# Altium project 04_DC_uz_ext_current_sensing_dsub_to_rj45_Rev02.PrjPcb
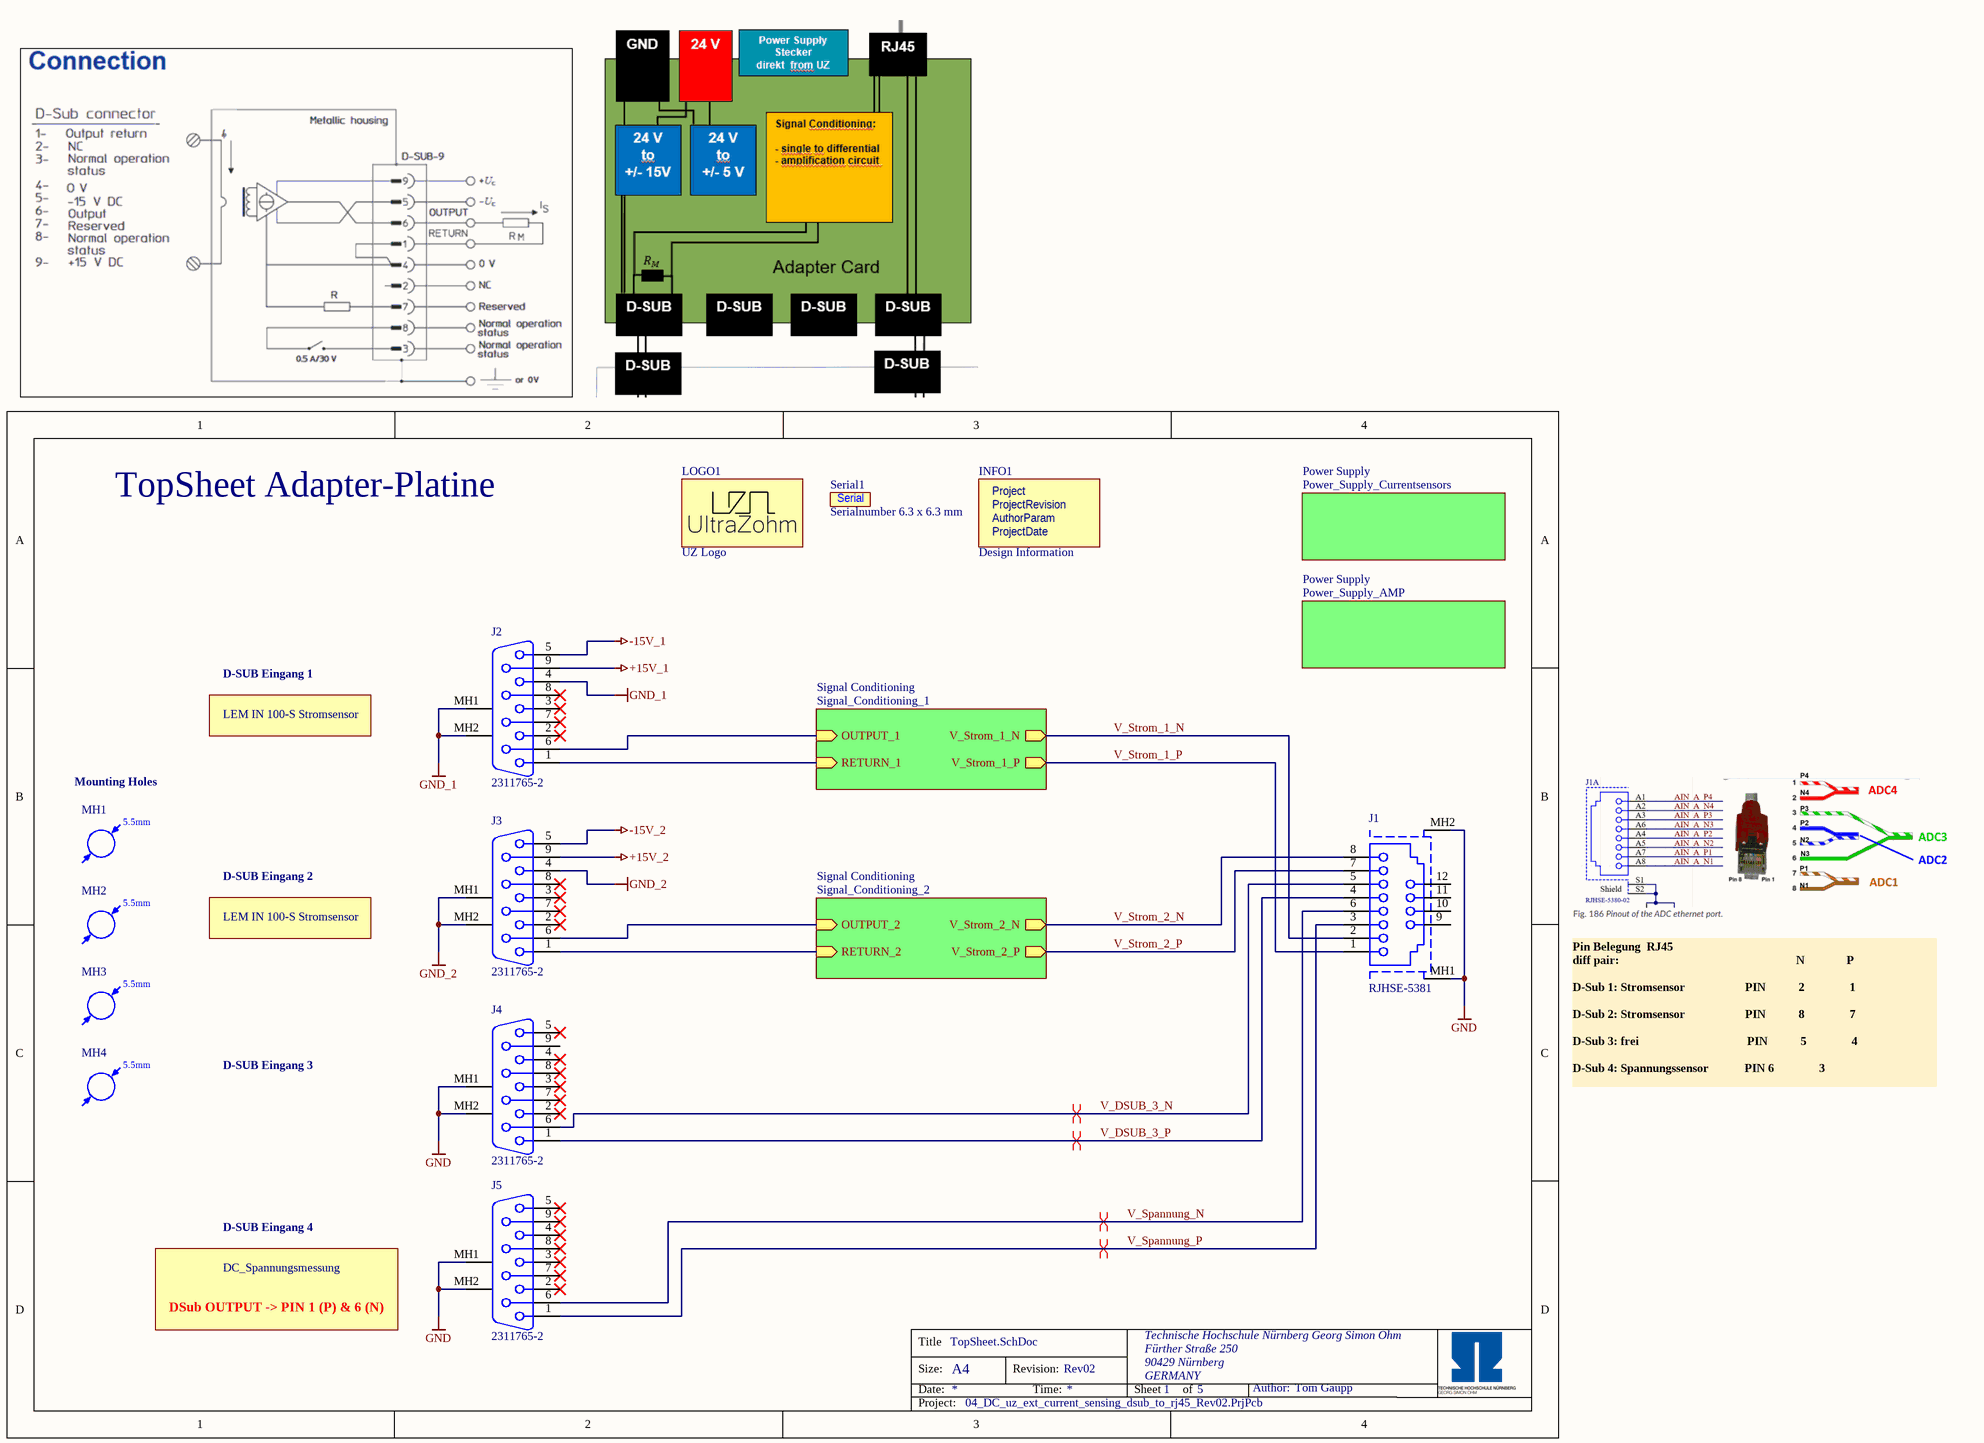
[diagram p0: TopSheet.SchDoc]
Author: Tom Gaupp; AuthorParam: Tom Gaupp; Project: uz_ext_current_sensing_dsub_to_rj45; ProjectDate: 06/24; ProjectRevision: Rev02
5 sheets, 70 parts. Net scope: hierarchical (ports join the sheet entries above them; power ports are global).
Board file: PCB_current_sensing_dsub_to_rj45.PcbDoc
Sheets:
  TopSheet.SchDoc
    Power Supply = Power_Supply_Currentsensors.SchDoc
    Signal Conditioning = Signal_Conditioning_1.SchDoc
    Signal Conditioning = Signal_Conditioning_2.SchDoc
    Power Supply = Power_Supply_AMP.SchDoc

## Sheet TopSheet.SchDoc
size A4; Website: www.ultrazohm.com; Author: Tom Gaupp; CompanyName: Technische Hochschule Nürnberg Georg Simon Ohm; Address1: Fürther Straße 250; Address2: 90429 Nürnberg; Address3: GERMANY; SheetNumber: 1; SheetTotal: 5; CompanyName2: Institut ELSYS

### Parts
INFO1  Design Information  [Design_info]  (no BOM)
J1  RJHSE-5381  [RJHSE-5381]
J2  2311765-2  [23117652]
J3  2311765-2  [23117652]
J4  2311765-2  [23117652]
J5  2311765-2  [23117652]
LOGO1  UZ Logo  [UZ_Logo_small]  (no BOM)
MH1  Mounting_Hole_M5  [Mounting Hole (M5)]  (value not drawn)
MH2  Mounting_Hole_M5  [Mounting Hole (M5)]  (value not drawn)
MH3  Mounting_Hole_M5  [Mounting Hole (M5)]  (value not drawn)
MH4  Mounting_Hole_M5  [Mounting Hole (M5)]  (value not drawn)
Serial1  Serialnumber 6.3 x 6.3 mm  [SERIAL_6.3X6.3MM]  (no BOM)

### Sub-sheets
Power Supply = Power_Supply_Currentsensors: no entries
Power Supply = Power_Supply_AMP: no entries
Signal Conditioning = Signal_Conditioning_1: RETURN_1 (in), OUTPUT_1 (in), V_Strom_1_N (out), V_Strom_1_P (out)
Signal Conditioning = Signal_Conditioning_2: RETURN_2 (in), OUTPUT_2 (in), V_Strom_2_N (out), V_Strom_2_P (out)

### Nets
+15V_1: J2.9
+15V_2: J3.9
-15V_1: J2.5
-15V_2: J3.5
GND: J1.MH1(Shell) J1.MH2(Shell) J4.MH1 J4.MH2 J5.MH1 J5.MH2
GND_1: J2.4 J2.MH1 J2.MH2
GND_2: J3.4 J3.MH1 J3.MH2
V_DSUB_3_N: J1.5 J4.6
V_DSUB_3_P: J1.4 J4.1
V_Spannung_N: J1.6 J5.6
V_Spannung_P: J1.3 J5.1
V_Strom_1_N: J1.2 ; sheet Signal Conditioning/V_Strom_1_N
V_Strom_1_P: J1.1 ; sheet Signal Conditioning/V_Strom_1_P
V_Strom_2_N: J1.8 ; sheet Signal Conditioning/V_Strom_2_N
V_Strom_2_P: J1.7 ; sheet Signal Conditioning/V_Strom_2_P
NetD1_2: J2.6 ; sheet Signal Conditioning/OUTPUT_1
NetD3_2: J2.1 ; sheet Signal Conditioning/RETURN_1
NetD5_2: J3.6 ; sheet Signal Conditioning/OUTPUT_2
NetD7_2: J3.1 ; sheet Signal Conditioning/RETURN_2

Not connected (* = marked no-connect by the designer): J1 9(8) 10(8) 11(8) 12(8); J2 2* 3* 7* 8*; J3 2* 3* 7* 8*; J4 2* 3* 4* 5* 7* 8* 9; J5 2* 3* 4* 5* 7* 8* 9*

### Layout directives
differential pair: V_DSUB_3_N, V_DSUB_3_P, V_Spannung_N, V_Spannung_P

### Notes on the sheet
- TopSheet Adapter-Platine
- D-SUB Eingang 1
- LEM IN 100-S Stromsensor
- Mounting Holes
- D-SUB Eingang 2
- D-SUB Eingang 3
- Pin Belegung  RJ45
  diff pair:                                                           N              P
  D-Sub 1: Stromsensor                    PIN           2               1
  D-Sub 2: Stromsensor                    PIN           8               7
  D-Sub 3: frei                                    PIN           5               4
  D-Sub 4: Spannungssensor            PIN	6               3
- D-SUB Eingang 4
- DSub OUTPUT -> PIN 1 (P) & 6 (N)
- DC_Spannungsmessung
- Title
- Size:
- Date:
- A4
- Revision:
- Time:
- Sheet
- of
- Author:
- Project:
- (in symbol Design Information) Project; ProjectRevision; AuthorParam; ProjectDate
- (in symbol Mounting_Hole_M5) 5.5mm
- (in symbol Serial Number) Serial

### Library data of the parts
INFO1 = Design Information: Design InformationS; Manufacturer: UltraZohm; Created from: MGremer; Manufacturer Part Number: Design Information; PartID: 12; Created On: 03.11.2021 09:04:23; ComponentLink1Description: https://docs.ultrazohm.com/; ComponentLink1URL: homepage; Component Type: Design Information; Last Updated: 03.11.2021 09:28:34; Supplier 1: -; Supplier Part Number 1: -; Type: Design Information; Value: Design Information; Live Cycle Status: 1
J1 = RJHSE-5381: Connector Ethernet R/A RJ45 SHIELDED 8 CONT Y/G LEDS; Supplier 1: Mouser; Supplier Part Number 1: 523-RJHSE-5381
J2-J5 = 2311765-2: Connector D-Sub 9 Pin Female; Manufacturer_Name: TE Connectivity; Datasheet Link: https://www.te.com/commerce/DocumentDelivery/DDEController?Action=showdoc&DocId=Customer+Drawing%7F2311765%7FD%7Fpdf%7FEnglish%7FENG_CD_2311765_D.pdf%7F2311765-2; Height: 12.8mm; Manufacturer_Part_Number: 2311765-2; Mouser Part Number: 571-2311765-2; Mouser Price/Stock: https://www.mouser.co.uk/ProductDetail/TE-Connectivity/2311765-2?qs=rrS6PyfT74frdzrH7SJRfg%3D%3D; Arrow Part Number: 2311765-2; Arrow Price/Stock: https://www.arrow.com/en/products/2311765-2/te-connectivity?region=nac
  J2: Supplier 1: Mouser; Supplier Part Number 1: 571-2311765-2
LOGO1 = Logo small: Manufacturer: UltraZohm; Created from: MGremer; Created: Jan2021_Liegmann; Value: Logo; Manufacturer Part Number: Logo small; PartID: 10; Created On: 03.11.2021 09:04:23; ComponentLink1Description: https://docs.ultrazohm.com/; ComponentLink1URL: homepage; Component Type: Logo; Last Updated: 03.11.2021 09:05:50; Supplier 1: -; Supplier Part Number 1: -; Type: Logo; Live Cycle Status: 1
MH1-MH4 = Mounting_Hole_M5: Mounting Hole
Serial1 = Serial Number: Manufacturer: UltraZohm; Value: REV; Created from: MGremer; Created: 2018_09_18_AGeiger; Manufacturer Part Number: Serial Number; PartID: 11; Created On: 03.11.2021 09:04:23; ComponentLink1Description: https://docs.ultrazohm.com/; ComponentLink1URL: homepage; Component Type: Serial Number; Last Updated: 03.11.2021 09:28:34; Supplier 1: -; Supplier Part Number 1: -; Type: Serial Number; Live Cycle Status: 1

## Sheet Power_Supply_Currentsensors.SchDoc
size A4; Author: Tom Gaupp; CompanyName: Technische Hochschule Nürnberg Georg Simon Ohm; Address1: Fürther Straße 250; Address2: 90429 Nürnberg; Address3: GERMANY; SheetNumber: 2; SheetTotal: 5; CompanyName2: Institut ELSYS
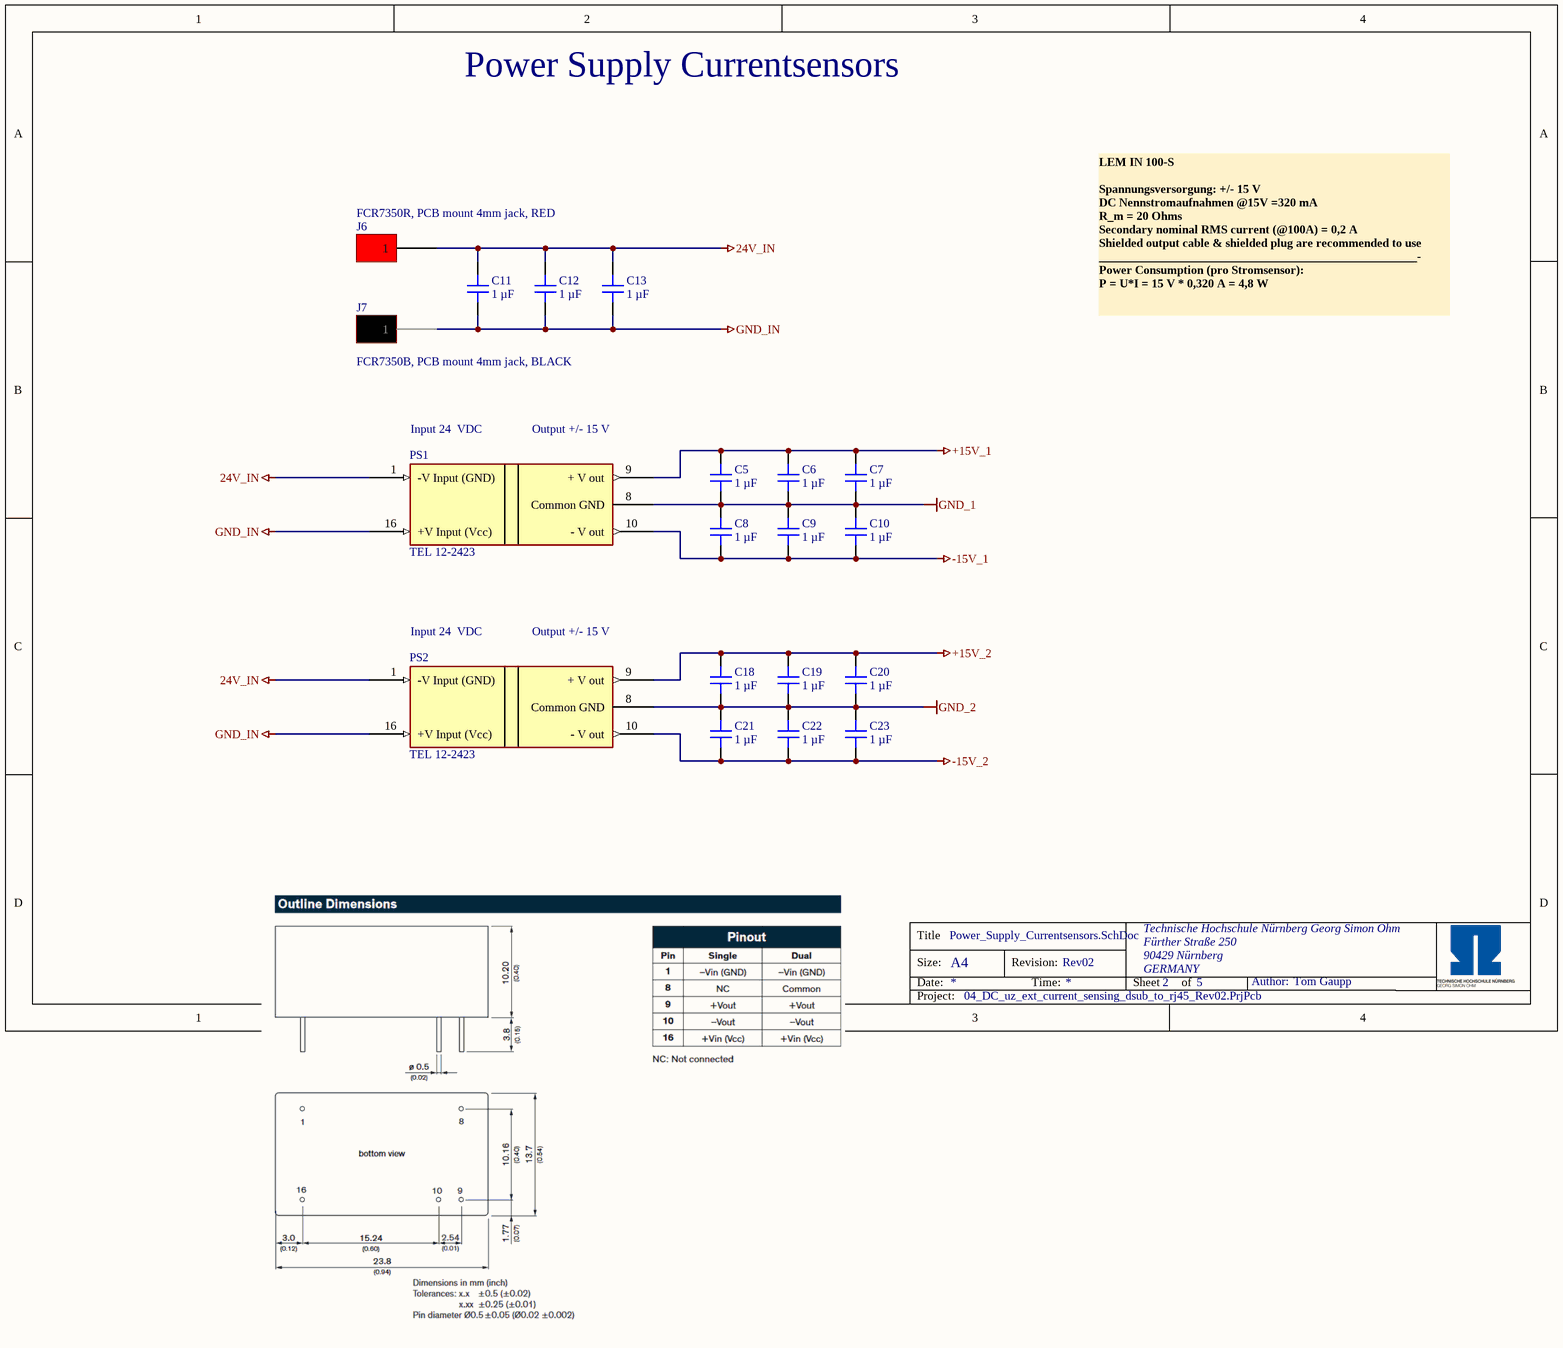
[diagram p1: Power_Supply_Currentsensors.SchDoc]

### Parts
C5  1 µF  [C_0603]
C6  1 µF  [C_0603]
C7  1 µF  [C_0603]
C8  1 µF  [C_0603]
C9  1 µF  [C_0603]
C10  1 µF  [C_0603]
C11  1 µF  [C_0603]
C12  1 µF  [C_0603]
C13  1 µF  [C_0603]
C18  1 µF  [C_0603]
C19  1 µF  [C_0603]
C20  1 µF  [C_0603]
C21  1 µF  [C_0603]
C22  1 µF  [C_0603]
C23  1 µF  [C_0603]
J6  FCR7350R, PCB mount 4mm jack, RED  [FCR7350]
J7  FCR7350B, PCB mount 4mm jack, BLACK  [FCR7350]
PS1  TEL 12-2423  [TEL 12-2423]
PS2  TEL 12-2423  [TEL 12-2423]

### Nets
24V_IN: C11.1 C12.1 C13.1 J6.1 PS1.1(-V_Input_(GND)) PS2.1(-V_Input_(GND))
+15V_1: C5.2 C6.2 C7.2 PS1.9(+_V_out)
+15V_2: C18.2 C19.2 C20.2 PS2.9(+_V_out)
-15V_1: C8.1 C9.1 C10.1 PS1.10(-_V_out)
-15V_2: C21.1 C22.1 C23.1 PS2.10(-_V_out)
GND_1: C5.1 C6.1 C7.1 C8.2 C9.2 C10.2 PS1.8(Common_GND)
GND_2: C18.1 C19.1 C20.1 C21.2 C22.2 C23.2 PS2.8(Common_GND)
GND_IN: C11.2 C12.2 C13.2 J7.1 PS1.16(+V_Input_(Vcc)) PS2.16(+V_Input_(Vcc))

### Notes on the sheet
- Power Supply Currentsensors
- LEM IN 100-S
  Spannungsversorgung: +/- 15 V
  DC Nennstromaufnahmen @15V =320 mA
  R_m = 20 Ohms
  Secondary nominal RMS current (@100A) = 0,2 A
  Shielded output cable & shielded plug are recommended to use
  _____________________________________________________-
  Power Consumption (pro Stromsensor):
  P = U*I = 15 V * 0,320 A = 4,8 W
- (near PS1) Input 24  VDC
- (near PS1) Output +/- 15 V
- (near PS2) Input 24  VDC
- (near PS2) Output +/- 15 V
- Title
- Size:
- Date:
- A4
- Revision:
- Time:
- Sheet
- of
- Author:
- Project:

### Library data of the parts
C5-C13 C18-C23 = CL10A105KB8NNNC: 50V 1uF X5R ±10% 0603  Multilayer Ceramic Capacitors MLCC - SMD/SMT ROHS; Manufacturer: Samsung Electro-Mechanics; Voltage Rating: 50 VDC; Created from: MGremer; Supplier 1: LCSC; Supplier Part Number 1: C15849; Manufacturer Part Number: CL10A105KB8NNNC; Value: 1 µF; PartID: 5; Created On: 20.12.2020 13:54:13; ComponentLink1Description: Datasheet; ComponentLink1URL: https://datasheet.lcsc.com/lcsc/1810261812_Samsung-Electro-Mechanics-CL10A105KB8NNNC_C15849.pdf; Component Type: Capacitor 0603; Device Package: 0603; Last Updated: 28.11.2022 17:23:01; Mounting Type: SMD; Operating Temperature: -55 - 85°C; Series: M; Type: Capacitor; Tolerance: 10 %; Live Cycle Status: 1; LCSC Part Number: C15849; Stock number: Labor SMD Container
J6 = FCR7350R: FCR7350B, 1000V, 24A, RED; Manufacturer: Cliff; Value: PCB mount 4mm jack, Red FCR7350R, 1000V, 24A; Created from: DHufnagel; Manufacturer Part Number: FCR7350R; PartID: 7; Created On: 13.06.2022 10:18:11; ComponentLink1Description: datasheet; ComponentLink1URL: https://www.cliffuk.co.uk/products/testleads/sockets/S16NPC.pdf; ComponentLink2Description: drawing; ComponentLink2URL: https://media.digikey.com/pdf/Data%20Sheets/Cliff%20Electronic%20LTD%20PDF's/FCR7350_Drawing.pdf; Component Type: PCB mount 4mm jack, Red; Device Package: THT; Last Updated: 28.06.2022 13:58:37; Minimum Order: 1; Mounting Type: THT; Operating Temperature: -40°C - 80°C; Series: S16N-PC; Supplier 1: Digi-Key; Supplier Part Number 1: 3185-FCR7350R-ND; Supplier 2: farnell; Supplier Part Number 2: 1854508; Type: PCB mount 4mm jack, Red FCR7350R, 1000V, 24A; Live Cycle Status: 1; Stock number: not stored
J7 = FCR7350B: FCR7350B, 1000V, 24A, BLACK; Manufacturer: Cliff; Value: PCB mount 4mm jack, Black	FCR7350B, 1000V, 24A; Created from: DHufnagel; Manufacturer Part Number: FCR7350B; PartID: 6; Created On: 13.06.2022 10:18:11; ComponentLink1Description: datasheet; ComponentLink1URL: https://www.cliffuk.co.uk/products/testleads/sockets/S16NPC.pdf; ComponentLink2Description: drawing; ComponentLink2URL: https://media.digikey.com/pdf/Data%20Sheets/Cliff%20Electronic%20LTD%20PDF's/FCR7350_Drawing.pdf; Component Type: PCB mount 4mm jack, Black; Device Package: THT; Last Updated: 28.06.2022 13:58:37; Minimum Order: 1; Mounting Type: THT; Operating Temperature: -40°C - 80°C; Series: S16N-PC; Supplier 1: Digi-Key; Supplier Part Number 1: 3185-FCR7350B-ND; Supplier 2: farnell; Supplier Part Number 2: 1854507; Type: PCB mount 4mm jack, Black	FCR7350B, 1000V, 24A; Live Cycle Status: 1; Stock number: not stored
PS1 PS2 = TEL 12-2423: Isolierte DC/DC-Wandler – Durchsteckmontage 18-36Vin+/-15V 400mA 12W DIP Iso; Parameter 1: *; Supplier 1: Mouser; Supplier Part Number 1: 490-PGNM1-S24-S5-S

## Sheet Signal_Conditioning_1.SchDoc
size A4; Author: Tom Gaupp; CompanyName: Technische Hochschule Nürnberg Georg Simon Ohm; Address1: Fürther Straße 250; Address2: 90429 Nürnberg; Address3: GERMANY; SheetNumber: 4; SheetTotal: 5; CompanyName2: Institut ELSYS
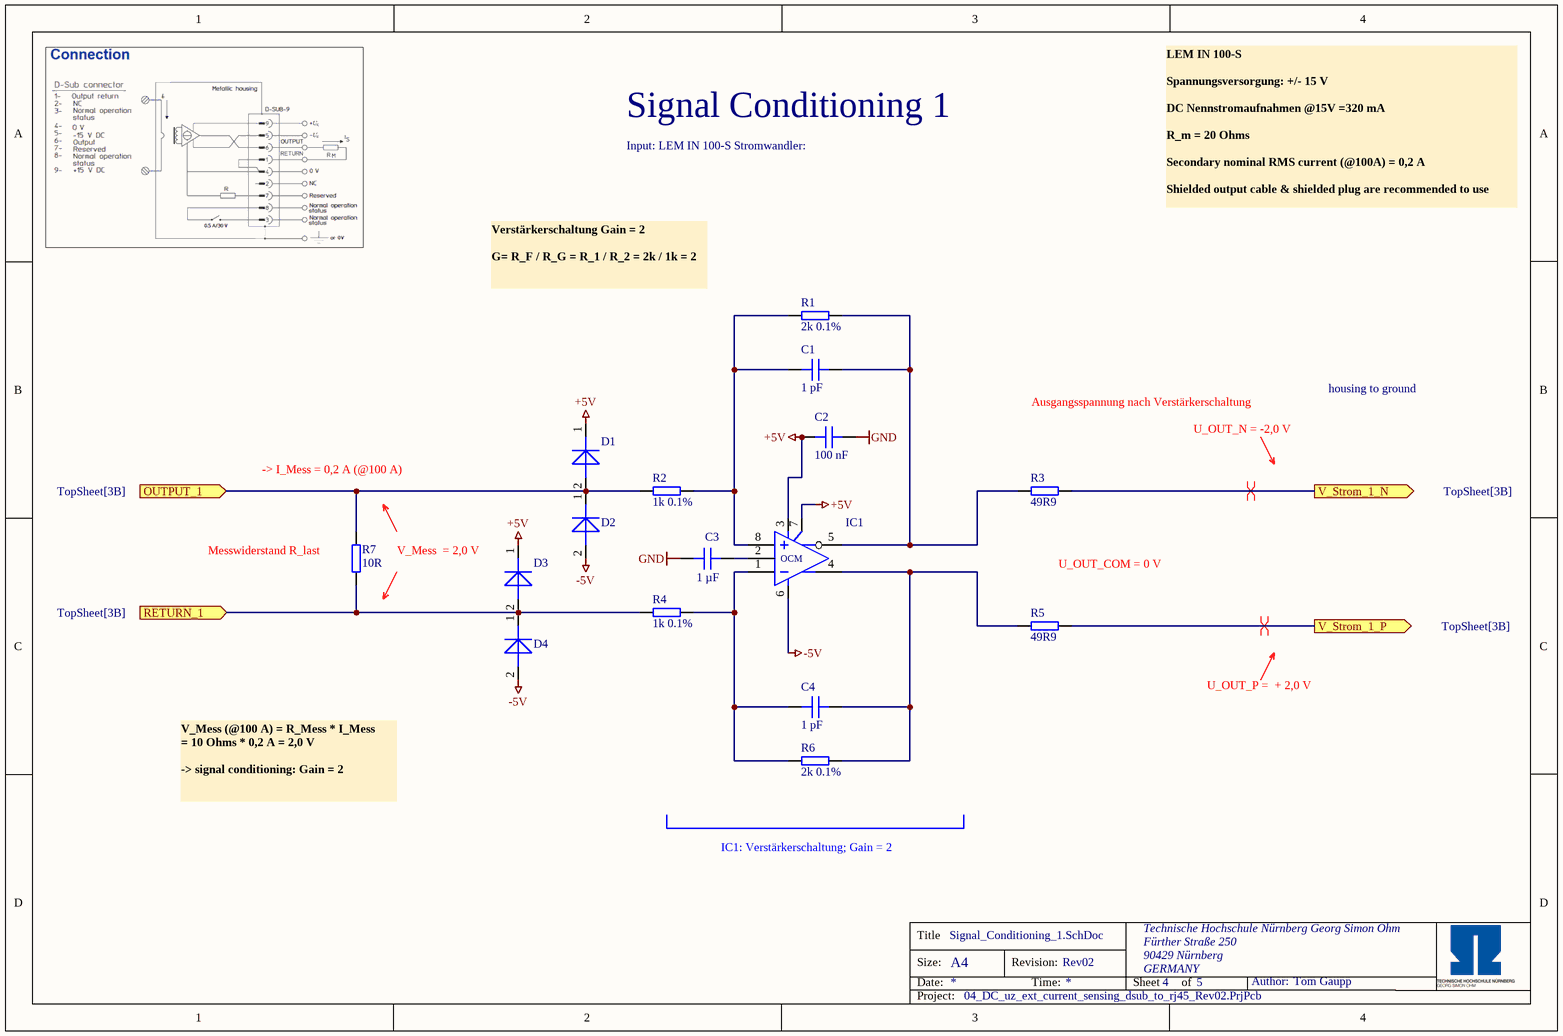
[diagram p2: Signal_Conditioning_1.SchDoc]

### Parts
C1  1 pF  [C_0603]
C2  100 nF  [C_0603]
C3  1 µF  [C_0603]
C4  1 pF  [C_0603]
D1  1SS356VMFHTE-17  [1SS356VMFHTE17]  (value not drawn)
D2  1SS356VMFHTE-17  [1SS356VMFHTE17]  (value not drawn)
D3  1SS356VMFHTE-17  [1SS356VMFHTE17]  (value not drawn)
D4  1SS356VMFHTE-17  [1SS356VMFHTE17]  (value not drawn)
IC1  ADA4940-1ARZ-R7  [SOIC-8-N]  (value not drawn)
R1  2k 0.1%  [RES 1206_3216]
R2  1k 0.1%  [RES 1206_3216]
R3  49R9  [RES 0603_1608]
R4  1k 0.1%  [RES 1206_3216]
R5  49R9  [RES 0603_1608]
R6  2k 0.1%  [RES 1206_3216]
R7  10R  [RES 1206_3216]

### Ports
OUTPUT_1 (in, see TopSheet[3B]), RETURN_1 (in, see TopSheet[3B]), V_Strom_1_N (out, see TopSheet[3B]), V_Strom_1_P (out, see TopSheet[3B])

### Nets
+5V: C2.1 D1.1(K) D3.1(K) IC1.3(V+) IC1.7(EN)
-5V: D2.2(A) D4.2(A) IC1.6(V-)
GND: C2.2 C3.1
V_Strom_1_N: R3.2 ; port V_Strom_1_N
V_Strom_1_P: R5.2 ; port V_Strom_1_P
NetC1_1: C1.1 IC1.8(+) R1.1 R2.2
NetC1_2: C1.2 IC1.5(Out) R1.2 R3.1
NetC3_2: C3.2 IC1.2(OCM)
NetC4_1: C4.1 IC1.1(-) R4.2 R6.1
NetC4_2: C4.2 IC1.4(Out) R5.1 R6.2
NetD1_2: D1.2(A) D2.1(K) R2.1 R7.2 ; port OUTPUT_1
NetD3_2: D3.2(A) D4.1(K) R4.1 R7.1 ; port RETURN_1

### Layout directives
differential pair: V_Strom_1_N, V_Strom_1_P

### Notes on the sheet
- Signal Conditioning 1
- Input: LEM IN 100-S Stromwandler:
- LEM IN 100-S
  Spannungsversorgung: +/- 15 V
  DC Nennstromaufnahmen @15V =320 mA
  R_m = 20 Ohms
  Secondary nominal RMS current (@100A) = 0,2 A
  Shielded output cable & shielded plug are recommended to use
- Verstärkerschaltung Gain = 2
  G= R_F / R_G = R_1 / R_2 = 2k / 1k = 2
- Ausgangsspannung nach Verstärkerschaltung
- U_OUT_N = -2,0 V
- housing to ground
- -> I_Mess = 0,2 A (@100 A)
- (near R7) Messwiderstand R_last
- V_Mess  = 2,0 V
- U_OUT_COM = 0 V
- U_OUT_P =  + 2,0 V
- V_Mess (@100 A) = R_Mess * I_Mess
  = 10 Ohms * 0,2 A = 2,0 V
  -> signal conditioning: Gain = 2
- IC1: Verstärkerschaltung; Gain = 2
- Title
- Size:
- Date:
- A4
- Revision:
- Time:
- Sheet
- of
- Author:
- Project:

### Library data of the parts
C1 C4 = KGM15ACG1H1R0BT: Multilayer Ceramic Capacitors MLCC - SMD/SMT 50V 1pF C0G 0603 +/-.1pF; Manufacturer: KYOCERA AVX; Tolerance: 10%; Voltage Rating: 50 VDC; Created from: TGaupp; Manufacturer Part Number: KGM15ACG1H1R0BT; PartID: 147; Created On: 13.02.2024 08:51:22; ComponentLink1Description: Datasheet; ComponentLink1URL: https://www.mouser.de/datasheet/2/40/C0GNP0_KGM-3216332.pdf; Component Type: Capacitor 0603; Device Package: 0603; Last Updated: 13.02.2024 08:51:22; Mounting Type: SMD; Operating Temperature: -55 to +125°C; Series: C0G; Supplier 1: Mouser; Supplier Part Number 1: 581-KGM15ACG1H1R0BT; Type: Capacitor; Value: 1 pF; Live Cycle Status: 1
C2 = C0603C104K9PACTU: Capacitor 0603, 6.3 VDC, 100 nF, X5R; Manufacturer: KEMET; Tolerance: 10 %; Voltage Rating: 6.3 VDC; Created from: MGremer; Manufacturer Part Number: C0603C104K9PACTU; PartID: 70; Created On: 20.12.2020 13:54:13; ComponentLink1Description: Datasheet; ComponentLink1URL: https://www.mouser.de/datasheet/2/212/KEM_C1006_X5R_SMD-1103249.pdf; Component Type: Capacitor 0603; Device Package: 0603; Last Updated: 20.01.2021 13:57:36; Mounting Type: SMD; Operating Temperature: -55 - 85°C; Series: SMD Comm X5R; Supplier 1: Mouser; Supplier Part Number 1: 80-C0603C104K9P; Type: Capacitor; Value: 100 nF; Live Cycle Status: 1; Stock number: not stored
C3 = CL10A105KB8NNNC: as C5 on sheet Power_Supply_Currentsensors; Supplier 1: LCSC; Supplier Part Number 1: C15849; Manufacturer Part Number: CL10A105KB8NNNC; Value: 1 µF; PartID: 5; Created On: 20.12.2020 13:54:13; ComponentLink1Description: Datasheet; ComponentLink1URL: https://datasheet.lcsc.com/lcsc/1810261812_Samsung-Electro-Mechanics-CL10A105KB8NNNC_C15849.pdf; Component Type: Capacitor 0603; Device Package: 0603; Last Updated: 28.11.2022 17:23:01; Mounting Type: SMD; Operating Temperature: -55 - 85°C; Series: M; Type: Capacitor; Tolerance: 10 %; Live Cycle Status: 1; LCSC Part Number: C15849; Stock number: Labor SMD Container
D1-D4 = 1SS356VMFHTE-17: Diode; Manufacturer_Name: ROHM Semiconductor; Datasheet Link: https://fscdn.rohm.com/en/products/databook/datasheet/discrete/diode/switching/1ss355vmfhte-17-e.pdf; Height: 0.9mm; Manufacturer_Part_Number: 1SS356VMFHTE-17; Mouser Part Number: 755-1SS356VMFHTE-17; Mouser Price/Stock: https://www.mouser.co.uk/ProductDetail/ROHM-Semiconductor/1SS356VMFHTE-17?qs=doiCPypUmgG12xHjyvfQdg%3D%3D; Supplier 1: Mouser; Supplier Part Number 1: 755-1SS356VMFHTE-17
IC1 = ADA4940-1ARZ-R7: Differential ADC Driver; Manufacturer: Analog Devices; Class I: Analog; Class II: Fully Differential ADC Drivers (-40-125°C); Best.-Nr.: Farnell 209-6178; Channels: 1; Created from: MGremer; Datasheet: DSO11449, Ver. Aug 2000; Last edited: 04.01.2007 10:14; Package Reference: SOIC-N-8; Manufacturer Part Number: ADA4940-1ARZ-R7; PartID: 3; Created On: 15.01.2021 12:16:53; ComponentLink1Description: Datasheet; ComponentLink1URL: https://www.mouser.de/datasheet/2/609/ADA4940-1_4940-2-878284.pdf; Component Type: ADC; Device Package: SOIC-8; Last Updated: 22.11.2021 15:19:18; Mounting Type: SMD; Operating Temperature: -40 - 105 °C; Supplier 1: Mouser; Supplier Part Number 1: 584-ADA4940-1ARZ-R7; Type: ADC; Resolution: -; Value: differential ADC driver; Live Cycle Status: 1; Stock number: not stored
R1 R6 = TNPW12062K00BEEA: SMD resistor 2Kohms .1% 400mW 25ppm; Manufacturer: Vishay; Created from: TGaupp; Manufacturer Part Number: TNPW12062K00BEEA; PartID: 323; Created On: 12.02.2024 09:48:36; ComponentLink1Description: Datasheet; ComponentLink1URL: https://www.vishay.com/docs/28758/tnpw_e3.pdf; Component Type: SMD resistor; Device Package: 1206; Last Updated: 12.02.2024 09:48:36; Mounting Type: SMD; Supplier 1: Mouser; Supplier Part Number 1: 71-TNPW12062K00BEEA; Type: Resistor; Tolerance: 0.1%; Value: 2k; Live Cycle Status: 1; Stock number: not stored
R2 R4 = ERA-8AEB102V: SMD resistor 1/4W 1.0Kohm 0.1% 25ppm; Manufacturer: Panasonic; Created from: TGaupp; Manufacturer Part Number: ERA-8AEB102V; PartID: 292; Created On: 08.08.2023 13:03:51; ComponentLink1Description: Datasheet; ComponentLink1URL: https://www.mouser.de/datasheet/2/315/AOA0000C307-1149632.pdf; Component Type: SMD resistor; Device Package: 1206; Last Updated: 08.08.2023 13:03:51; Mounting Type: SMD; Supplier 1: Mouser; Supplier Part Number 1: 667-ERA-8AEB102V; Type: Resistor; Tolerance: 0.1%; Value: 1k; Live Cycle Status: 1; Stock number: not stored; LCSC Part Number: C2079586
R3 R5 = RC0603FR-0749R9L: 100mW Thick Film Resistors ±100ppm/℃ ±1% 49.9Ω 0603 Chip Resistor - Surface Mount ROHS; Manufacturer: YAGEO; Created from: AGeiger; Manufacturer Part Number: RC0603FR-0749R9L; PartID: 277; Created On: 14.06.2023 17:42:26; ComponentLink1Description: Datasheet; ComponentLink1URL: https://datasheet.lcsc.com/lcsc/2304140030_YAGEO-RC0603FR-0749R9L_C114625.pdf; Component Type: SMD resistor; Device Package: 0603; Last Updated: 14.06.2023 17:42:26; Mounting Type: SMD; Type: Resistor; Tolerance: 1%; Value: 49R9; Live Cycle Status: 1; LCSC Part Number: C114625; Supplier 1: Mouser; Supplier Part Number 1: 603-RC0402FR-0749R9L
R7 = SG73G2BTTD10R0D: SMD 10 ohm 0.5% 0.5W; Manufacturer: KOA Speer; Created from: TGaupp; Manufacturer Part Number: SG73G2BTTD10R0D; PartID: 329; Created On: 13.03.2024 10:06:45; ComponentLink1Description: Datasheet; ComponentLink1URL: https://www.koaspeer.com/pdfs/SG73G.pdf; Component Type: SMD resistor; Device Package: 1206; Last Updated: 13.03.2024 10:06:45; Mounting Type: SMD; Supplier 1: Mouser; Supplier Part Number 1: 660-SG73G2BTTD10R0D; Type: Resistor; Tolerance: 0.5%; Value: 10R; Live Cycle Status: 1; Stock number: not stored

## Sheet Signal_Conditioning_2.SchDoc
size A4; Author: Tom Gaupp; CompanyName: Technische Hochschule Nürnberg Georg Simon Ohm; Address1: Fürther Straße 250; Address2: 90429 Nürnberg; Address3: GERMANY; SheetNumber: 5; SheetTotal: 5; CompanyName2: Institut ELSYS
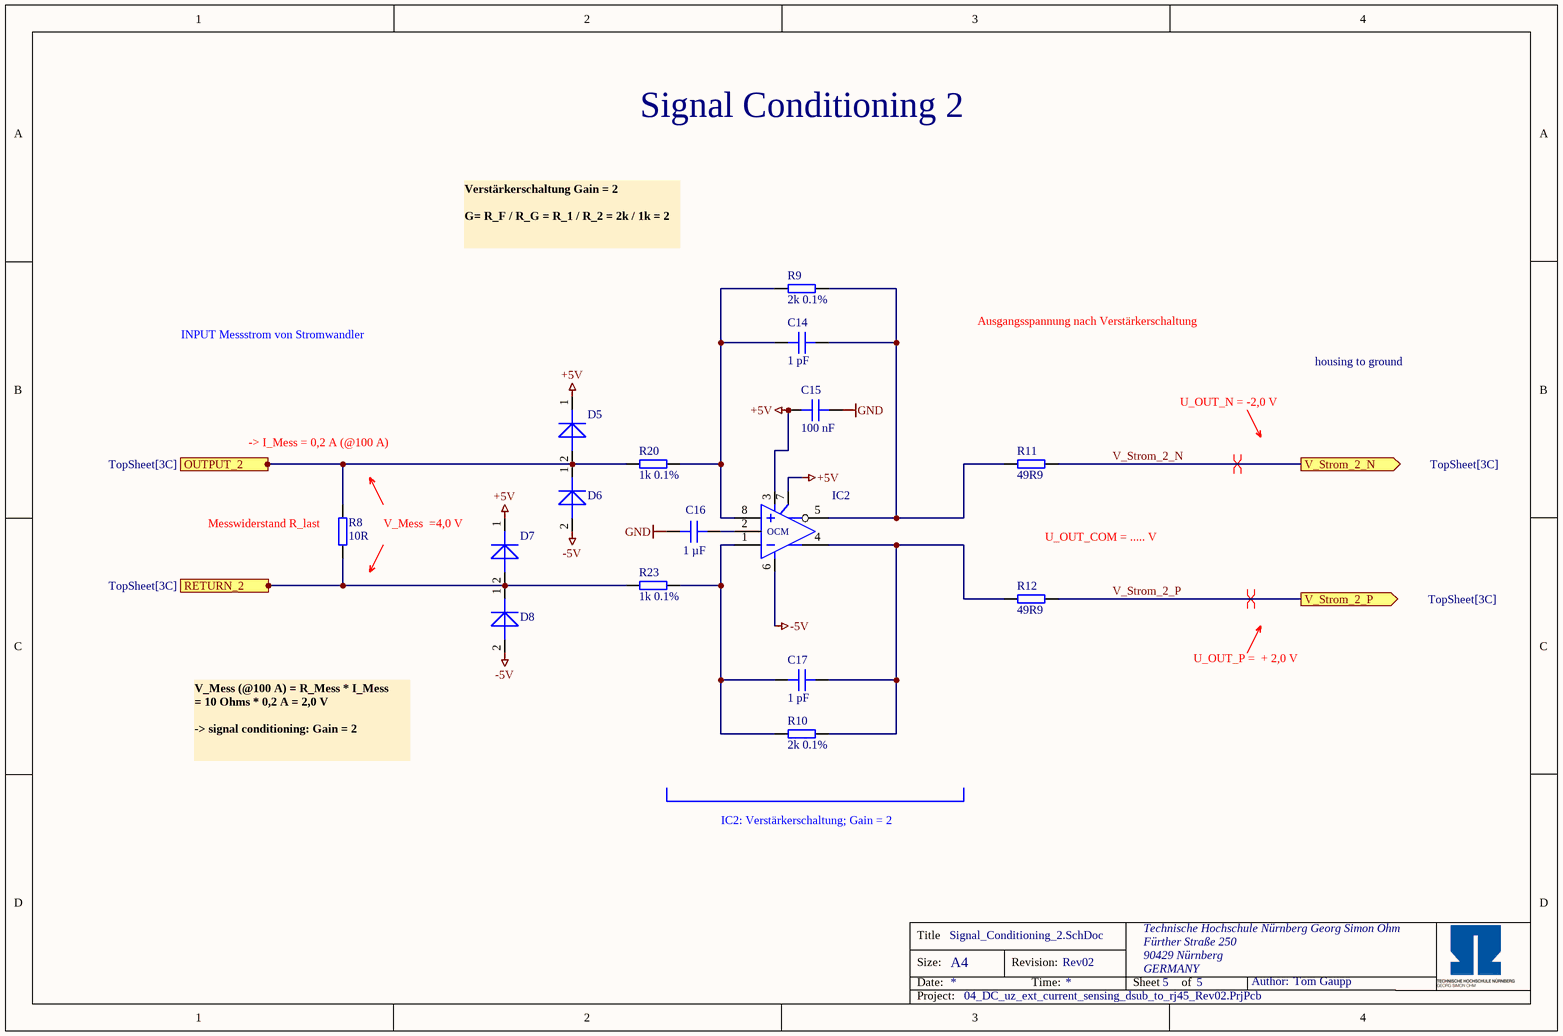
[diagram p3: Signal_Conditioning_2.SchDoc]

### Parts
C14  1 pF  [C_0603]
C15  100 nF  [C_0603]
C16  1 µF  [C_0603]
C17  1 pF  [C_0603]
D5  1SS356VMFHTE-17  [1SS356VMFHTE17]  (value not drawn)
D6  1SS356VMFHTE-17  [1SS356VMFHTE17]  (value not drawn)
D7  1SS356VMFHTE-17  [1SS356VMFHTE17]  (value not drawn)
D8  1SS356VMFHTE-17  [1SS356VMFHTE17]  (value not drawn)
IC2  ADA4940-1ARZ-R7  [SOIC-8-N]  (value not drawn)
R8  10R  [RES 1206_3216]
R9  2k 0.1%  [RES 1206_3216]
R10  2k 0.1%  [RES 1206_3216]
R11  49R9  [RES 0603_1608]
R12  49R9  [RES 0603_1608]
R20  1k 0.1%  [RES 1206_3216]
R23  1k 0.1%  [RES 1206_3216]

### Ports
OUTPUT_2 (in, see TopSheet[3C]), RETURN_2 (in, see TopSheet[3C]), V_Strom_2_N (out, see TopSheet[3C]), V_Strom_2_P (out, see TopSheet[3C])

### Nets
+5V: C15.1 D5.1(K) D7.1(K) IC2.3(V+) IC2.7(EN)
-5V: D6.2(A) D8.2(A) IC2.6(V-)
GND: C15.2 C16.1
V_Strom_2_N: R11.2 ; port V_Strom_2_N
V_Strom_2_P: R12.2 ; port V_Strom_2_P
NetC14_1: C14.1 IC2.8(+) R9.1 R20.2
NetC14_2: C14.2 IC2.5(Out) R9.2 R11.1
NetC16_2: C16.2 IC2.2(OCM)
NetC17_1: C17.1 IC2.1(-) R10.1 R23.2
NetC17_2: C17.2 IC2.4(Out) R10.2 R12.1
NetD5_2: D5.2(A) D6.1(K) R8.2 R20.1 ; port OUTPUT_2
NetD7_2: D7.2(A) D8.1(K) R8.1 R23.1 ; port RETURN_2

### Layout directives
differential pair: V_Strom_2_N, V_Strom_2_P

### Notes on the sheet
- Signal Conditioning 2
- Verstärkerschaltung Gain = 2
  G= R_F / R_G = R_1 / R_2 = 2k / 1k = 2
- INPUT Messstrom von Stromwandler
- Ausgangsspannung nach Verstärkerschaltung
- housing to ground
- -> I_Mess = 0,2 A (@100 A)
- U_OUT_N = -2,0 V
- (near R8) Messwiderstand R_last
- V_Mess  =4,0 V
- U_OUT_COM = ..... V
- U_OUT_P =  + 2,0 V
- V_Mess (@100 A) = R_Mess * I_Mess
  = 10 Ohms * 0,2 A = 2,0 V
  -> signal conditioning: Gain = 2
- IC2: Verstärkerschaltung; Gain = 2
- Title
- Size:
- Date:
- A4
- Revision:
- Time:
- Sheet
- of
- Author:
- Project:

### Library data of the parts
C14 C17 = KGM15ACG1H1R0BT: as C1 on sheet Signal_Conditioning_1; Manufacturer Part Number: KGM15ACG1H1R0BT; PartID: 147; Created On: 13.02.2024 08:51:22; ComponentLink1Description: Datasheet; ComponentLink1URL: https://www.mouser.de/datasheet/2/40/C0GNP0_KGM-3216332.pdf; Component Type: Capacitor 0603; Device Package: 0603; Last Updated: 13.02.2024 08:51:22; Mounting Type: SMD; Operating Temperature: -55 to +125°C; Series: C0G; Supplier 1: Mouser; Supplier Part Number 1: 581-KGM15ACG1H1R0BT; Type: Capacitor; Value: 1 pF; Live Cycle Status: 1
C15 = C0603C104K9PACTU: as C2 on sheet Signal_Conditioning_1; Manufacturer Part Number: C0603C104K9PACTU; PartID: 70; Created On: 20.12.2020 13:54:13; ComponentLink1Description: Datasheet; ComponentLink1URL: https://www.mouser.de/datasheet/2/212/KEM_C1006_X5R_SMD-1103249.pdf; Component Type: Capacitor 0603; Device Package: 0603; Last Updated: 20.01.2021 13:57:36; Mounting Type: SMD; Operating Temperature: -55 - 85°C; Series: SMD Comm X5R; Supplier 1: Mouser; Supplier Part Number 1: 80-C0603C104K9P; Type: Capacitor; Value: 100 nF; Live Cycle Status: 1; Stock number: not stored
C16 = CL10A105KB8NNNC: as C5 on sheet Power_Supply_Currentsensors; Supplier 1: LCSC; Supplier Part Number 1: C15849; Manufacturer Part Number: CL10A105KB8NNNC; Value: 1 µF; PartID: 5; Created On: 20.12.2020 13:54:13; ComponentLink1Description: Datasheet; ComponentLink1URL: https://datasheet.lcsc.com/lcsc/1810261812_Samsung-Electro-Mechanics-CL10A105KB8NNNC_C15849.pdf; Component Type: Capacitor 0603; Device Package: 0603; Last Updated: 28.11.2022 17:23:01; Mounting Type: SMD; Operating Temperature: -55 - 85°C; Series: M; Type: Capacitor; Tolerance: 10 %; Live Cycle Status: 1; LCSC Part Number: C15849; Stock number: Labor SMD Container
D5-D8 = 1SS356VMFHTE-17: as D1 on sheet Signal_Conditioning_1; Datasheet Link: https://fscdn.rohm.com/en/products/databook/datasheet/discrete/diode/switching/1ss355vmfhte-17-e.pdf; Height: 0.9mm; Manufacturer_Part_Number: 1SS356VMFHTE-17; Mouser Part Number: 755-1SS356VMFHTE-17; Mouser Price/Stock: https://www.mouser.co.uk/ProductDetail/ROHM-Semiconductor/1SS356VMFHTE-17?qs=doiCPypUmgG12xHjyvfQdg%3D%3D; Supplier 1: Mouser; Supplier Part Number 1: 755-1SS356VMFHTE-17
IC2 = ADA4940-1ARZ-R7: as IC1 on sheet Signal_Conditioning_1; Datasheet: DSO11449, Ver. Aug 2000; Last edited: 04.01.2007 10:14; Package Reference: SOIC-N-8; Manufacturer Part Number: ADA4940-1ARZ-R7; PartID: 3; Created On: 15.01.2021 12:16:53; ComponentLink1Description: Datasheet; ComponentLink1URL: https://www.mouser.de/datasheet/2/609/ADA4940-1_4940-2-878284.pdf; Component Type: ADC; Device Package: SOIC-8; Last Updated: 22.11.2021 15:19:18; Mounting Type: SMD; Operating Temperature: -40 - 105 °C; Supplier 1: Mouser; Supplier Part Number 1: 584-ADA4940-1ARZ-R7; Type: ADC; Resolution: -; Value: differential ADC driver; Live Cycle Status: 1; Stock number: not stored
R8 = SG73G2BTTD10R0D: as R7 on sheet Signal_Conditioning_1; Manufacturer Part Number: SG73G2BTTD10R0D; PartID: 329; Created On: 13.03.2024 10:06:45; ComponentLink1Description: Datasheet; ComponentLink1URL: https://www.koaspeer.com/pdfs/SG73G.pdf; Component Type: SMD resistor; Device Package: 1206; Last Updated: 13.03.2024 10:06:45; Mounting Type: SMD; Supplier 1: Mouser; Supplier Part Number 1: 660-SG73G2BTTD10R0D; Type: Resistor; Tolerance: 0.5%; Value: 10R; Live Cycle Status: 1; Stock number: not stored
R9 R10 = TNPW12062K00BEEA: as R1 on sheet Signal_Conditioning_1; Manufacturer Part Number: TNPW12062K00BEEA; PartID: 323; Created On: 12.02.2024 09:48:36; ComponentLink1Description: Datasheet; ComponentLink1URL: https://www.vishay.com/docs/28758/tnpw_e3.pdf; Component Type: SMD resistor; Device Package: 1206; Last Updated: 12.02.2024 09:48:36; Mounting Type: SMD; Supplier 1: Mouser; Supplier Part Number 1: 71-TNPW12062K00BEEA; Type: Resistor; Tolerance: 0.1%; Value: 2k; Live Cycle Status: 1; Stock number: not stored
R11 R12 = RC0603FR-0749R9L: as R3 on sheet Signal_Conditioning_1; Manufacturer Part Number: RC0603FR-0749R9L; PartID: 277; Created On: 14.06.2023 17:42:26; ComponentLink1Description: Datasheet; ComponentLink1URL: https://datasheet.lcsc.com/lcsc/2304140030_YAGEO-RC0603FR-0749R9L_C114625.pdf; Component Type: SMD resistor; Device Package: 0603; Last Updated: 14.06.2023 17:42:26; Mounting Type: SMD; Type: Resistor; Tolerance: 1%; Value: 49R9; Live Cycle Status: 1; LCSC Part Number: C114625; Supplier 1: Mouser; Supplier Part Number 1: 603-RC0402FR-0749R9L
R20 R23 = ERA-8AEB102V: as R2 on sheet Signal_Conditioning_1; Manufacturer Part Number: ERA-8AEB102V; PartID: 292; Created On: 08.08.2023 13:03:51; ComponentLink1Description: Datasheet; ComponentLink1URL: https://www.mouser.de/datasheet/2/315/AOA0000C307-1149632.pdf; Component Type: SMD resistor; Device Package: 1206; Last Updated: 08.08.2023 13:03:51; Mounting Type: SMD; Supplier 1: Mouser; Supplier Part Number 1: 667-ERA-8AEB102V; Type: Resistor; Tolerance: 0.1%; Value: 1k; Live Cycle Status: 1; Stock number: not stored; LCSC Part Number: C2079586

## Sheet Power_Supply_AMP.SchDoc
size A4; Author: Tom Gaupp; CompanyName: Technische Hochschule Nürnberg Georg Simon Ohm; Address1: Fürther Straße 250; Address2: 90429 Nürnberg; Address3: GERMANY; SheetNumber: 3; SheetTotal: 5; CompanyName2: Institut ELSYS
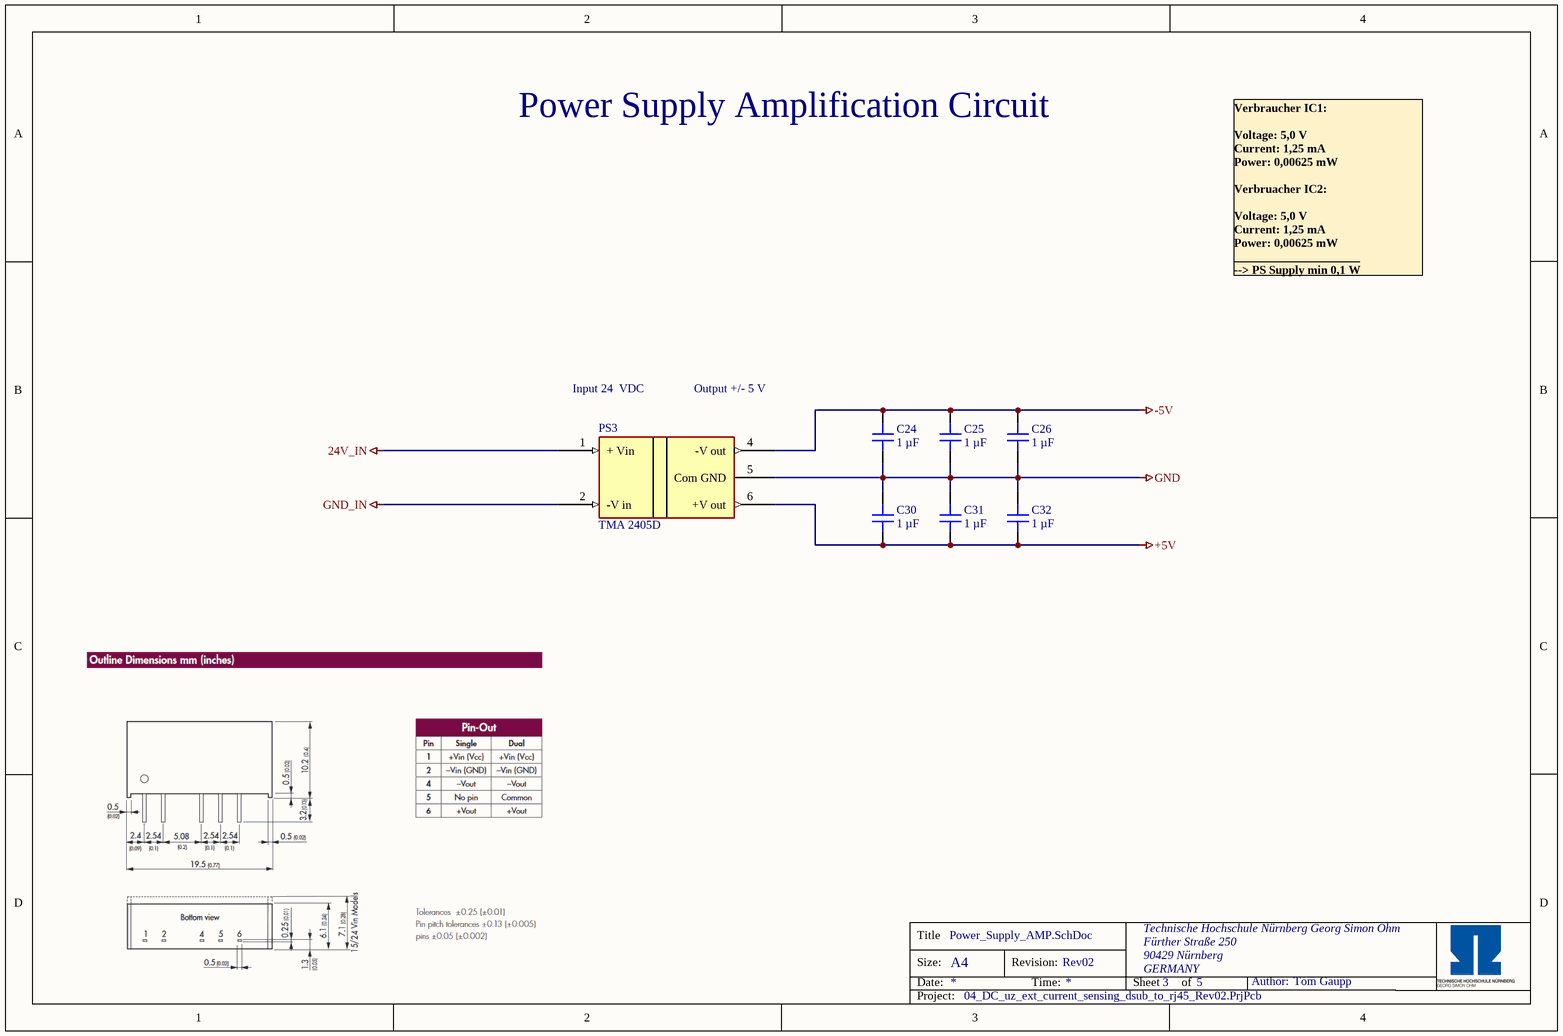
[diagram p4: Power_Supply_AMP.SchDoc]

### Parts
C24  1 µF  [C_0603]
C25  1 µF  [C_0603]
C26  1 µF  [C_0603]
C30  1 µF  [C_0603]
C31  1 µF  [C_0603]
C32  1 µF  [C_0603]
PS3  TMA 2405D  [TMA 2405D]

### Nets
24V_IN: PS3.1(+_Vin)
+5V: C30.1 C31.1 C32.1 PS3.6(+V_out)
-5V: C24.2 C25.2 C26.2 PS3.4(-V_out)
GND: C24.1 C25.1 C26.1 C30.2 C31.2 C32.2 PS3.5(Com_GND)
GND_IN: PS3.2(-V_in)

### Notes on the sheet
- Power Supply Amplification Circuit
- Verbraucher IC1:
  Voltage: 5,0 V
  Current: 1,25 mA
  Power: 0,00625 mW
  Verbruacher IC2:
  Voltage: 5,0 V
  Current: 1,25 mA
  Power: 0,00625 mW
  _____________________
  --> PS Supply min 0,1 W
- Input 24  VDC
- Output +/- 5 V
- Title
- Size:
- Date:
- A4
- Revision:
- Time:
- Sheet
- of
- Author:
- Project:

### Library data of the parts
C24-C26 C30-C32 = CL10A105KB8NNNC: as C5 on sheet Power_Supply_Currentsensors; Supplier 1: LCSC; Supplier Part Number 1: C15849; Manufacturer Part Number: CL10A105KB8NNNC; Value: 1 µF; PartID: 5; Created On: 20.12.2020 13:54:13; ComponentLink1Description: Datasheet; ComponentLink1URL: https://datasheet.lcsc.com/lcsc/1810261812_Samsung-Electro-Mechanics-CL10A105KB8NNNC_C15849.pdf; Component Type: Capacitor 0603; Device Package: 0603; Last Updated: 28.11.2022 17:23:01; Mounting Type: SMD; Operating Temperature: -55 - 85°C; Series: M; Type: Capacitor; Tolerance: 10 %; Live Cycle Status: 1; LCSC Part Number: C15849; Stock number: Labor SMD Container
PS3 = TMA 2405D: Isolierte DC/DC-Wandler – Durchsteckmontage Product Type: DC/DC; Package Style: SIP; Output Power (W): 1; Input Voltage: 24 VDC +/-10%; Output 1 (Vdc): 5; Output 2 (Vdc): -5; Output 3 (Vdc): N/A; Parameter 1: *; Supplier 1: Mouser; Supplier Part Number 1: 490-PGNM1-S24-S5-S

## Nets that join several sheets
24V_IN: Power_Supply_Currentsensors (6 pins), Power_Supply_AMP (PS3.1)
+5V: Signal_Conditioning_1 (5 pins), Signal_Conditioning_2 (5 pins), Power_Supply_AMP (C30.1 C31.1 C32.1 PS3.6)
+15V_1: TopSheet (J2.9), Power_Supply_Currentsensors (C5.2 C6.2 C7.2 PS1.9)
+15V_2: TopSheet (J3.9), Power_Supply_Currentsensors (C18.2 C19.2 C20.2 PS2.9)
-5V: Signal_Conditioning_1 (D2.2 D4.2 IC1.6), Signal_Conditioning_2 (D6.2 D8.2 IC2.6), Power_Supply_AMP (C24.2 C25.2 C26.2 PS3.4)
-15V_1: TopSheet (J2.5), Power_Supply_Currentsensors (C8.1 C9.1 C10.1 PS1.10)
-15V_2: TopSheet (J3.5), Power_Supply_Currentsensors (C21.1 C22.1 C23.1 PS2.10)
GND: TopSheet (6 pins), Signal_Conditioning_1 (C2.2 C3.1), Signal_Conditioning_2 (C15.2 C16.1), Power_Supply_AMP (7 pins)
GND_1: TopSheet (J2.4 J2.MH1 J2.MH2), Power_Supply_Currentsensors (7 pins)
GND_2: TopSheet (J3.4 J3.MH1 J3.MH2), Power_Supply_Currentsensors (7 pins)
GND_IN: Power_Supply_Currentsensors (6 pins), Power_Supply_AMP (PS3.2)
NetD1_2: TopSheet (J2.6), Signal_Conditioning_1 (D1.2 D2.1 R2.1 R7.2)
NetD3_2: TopSheet (J2.1), Signal_Conditioning_1 (D3.2 D4.1 R4.1 R7.1)
NetD5_2: TopSheet (J3.6), Signal_Conditioning_2 (D5.2 D6.1 R8.2 R20.1)
NetD7_2: TopSheet (J3.1), Signal_Conditioning_2 (D7.2 D8.1 R8.1 R23.1)
V_Strom_1_N: TopSheet (J1.2), Signal_Conditioning_1 (R3.2)
V_Strom_1_P: TopSheet (J1.1), Signal_Conditioning_1 (R5.2)
V_Strom_2_N: TopSheet (J1.8), Signal_Conditioning_2 (R11.2)
V_Strom_2_P: TopSheet (J1.7), Signal_Conditioning_2 (R12.2)